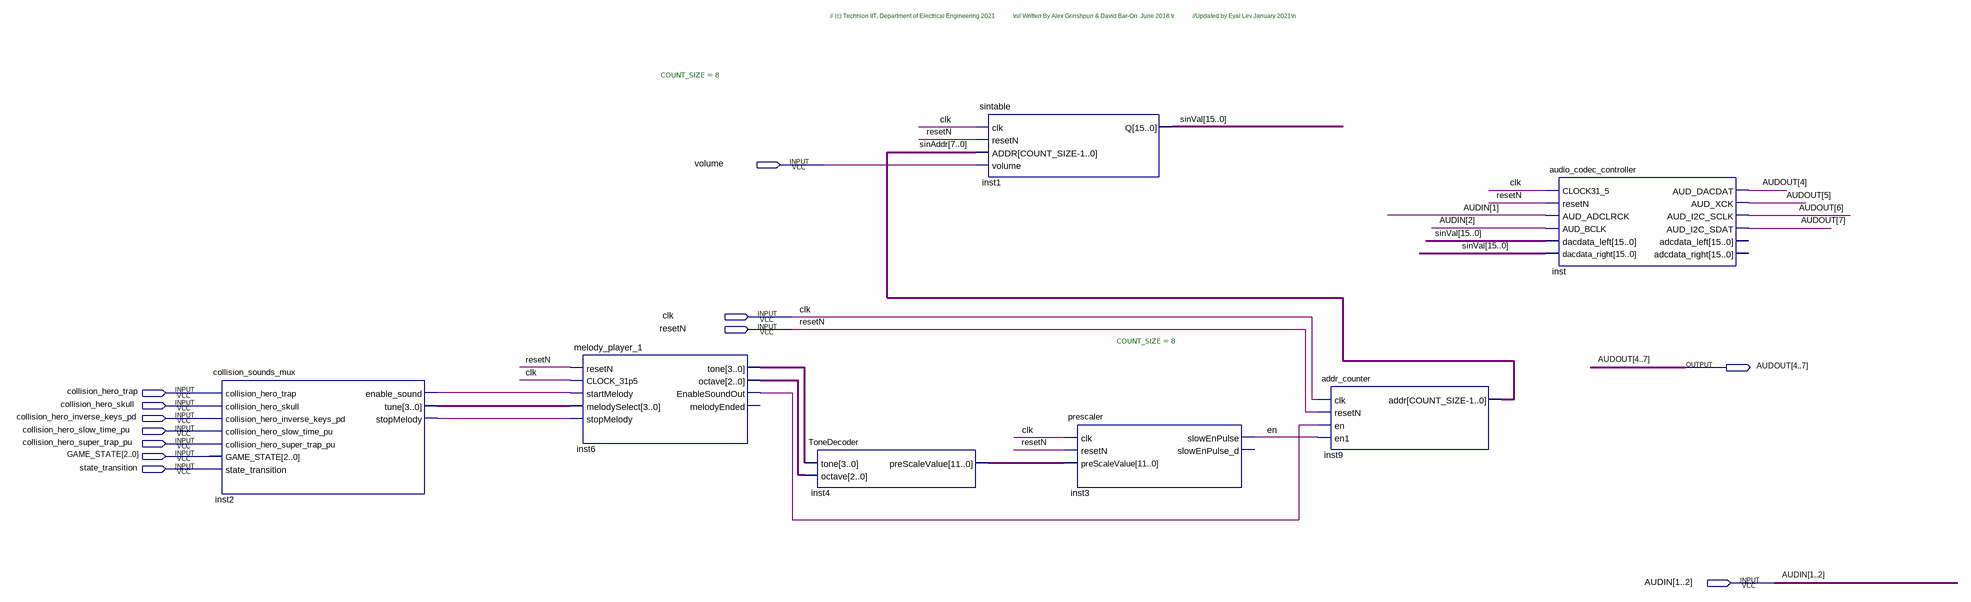
[diagram p0: schematic sheet]
// Quartus schematic AUDIO.bdf as structural Verilog: 7 symbols, 12 pins
module AUDIO (
  input  volume,
  input  clk,
  input  resetN,
  input  collision_hero_trap,
  input  collision_hero_skull,
  input  collision_hero_inverse_keys_pd,
  input  collision_hero_slow_time_pu,
  input  collision_hero_super_trap_pu,
  input  [2:0] GAME_STATE,
  input  state_transition,
  input  [1:2] AUDIN,
  output [4:7] AUDOUT
);

  wire en, inst2_enable_sound, inst2_stopmelody, inst6_enablesoundout;
  wire [2:0] inst6_octave;
  wire [3:0] inst2_tune, inst6_tone;
  wire [7:0] sinAddr;
  wire [11:0] inst4_prescalevalue;
  wire [15:0] sinVal;

  collision_sounds_mux inst2 (
    .collision_hero_trap(collision_hero_trap), .collision_hero_skull(collision_hero_skull),
    .collision_hero_inverse_keys_pd(collision_hero_inverse_keys_pd),
    .collision_hero_slow_time_pu(collision_hero_slow_time_pu),
    .collision_hero_super_trap_pu(collision_hero_super_trap_pu), .GAME_STATE(GAME_STATE),
    .state_transition(state_transition), .enable_sound(inst2_enable_sound), .tune(inst2_tune),
    .stopMelody(inst2_stopmelody));
  melody_player_1 inst6 (
    .resetN(resetN), .CLOCK_31p5(clk), .startMelody(inst2_enable_sound), .melodySelect(inst2_tune),
    .stopMelody(inst2_stopmelody), .tone(inst6_tone), .octave(inst6_octave),
    .EnableSoundOut(inst6_enablesoundout));  // open: melodyEnded
  ToneDecoder inst4 (.tone(inst6_tone), .octave(inst6_octave), .preScaleValue(inst4_prescalevalue));
  sintable #(.COUNT_SIZE(8)) inst1 (.clk(clk), .resetN(resetN), .ADDR(sinAddr), .volume(volume), .Q(sinVal));
  prescaler inst3 (
    .clk(clk), .resetN(resetN), .preScaleValue(inst4_prescalevalue), .slowEnPulse(en));  // open: slowEnPulse_d
  addr_counter #(.COUNT_SIZE(8)) inst9 (
    .clk(clk), .resetN(resetN), .en(inst6_enablesoundout), .en1(en), .addr(sinAddr));
  audio_codec_controller inst (
    .CLOCK31_5(clk), .resetN(resetN), .AUD_ADCLRCK(AUDIN[1]), .AUD_BCLK(AUDIN[2]), .dacdata_left(sinVal),
    .dacdata_right(sinVal), .AUD_DACDAT(AUDOUT[4]), .AUD_XCK(AUDOUT[5]), .AUD_I2C_SCLK(AUDOUT[6]),
    .AUD_I2C_SDAT(AUDOUT[7]));  // open: adcdata_left, adcdata_right

  // Notes on the sheet:
  //   // (c) Technion IIT, Department of Electrical Engineering 2021            \n// Written By Alex Grinshpun & David Bar-On  June 2018 \r            //Updated by Eyal Lev January 2021\n
endmodule
